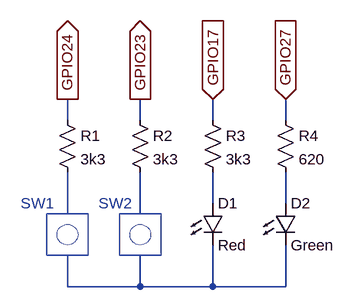
[diagram p0: schematic GpioBoard.asc]
GpioBoard.asc, the LTspice schematic file:
Version 4
SHEET 1 880 680
WIRE -64 -208 -64 -240
WIRE 48 -208 48 -240
WIRE 160 -208 160 -240
WIRE 272 -208 272 -240
WIRE 160 -80 160 -128
WIRE 272 -80 272 -128
WIRE -64 -64 -64 -128
WIRE 48 -64 48 -128
WIRE -64 48 -64 0
WIRE 48 48 48 0
WIRE 48 48 -64 48
WIRE 160 48 160 -16
WIRE 160 48 48 48
WIRE 272 48 272 -16
WIRE 272 48 160 48
FLAG 160 -240 GPIO17
IOPIN 160 -240 In
FLAG 272 -240 GPIO27
IOPIN 272 -240 In
FLAG 48 -240 GPIO23
IOPIN 48 -240 Out
FLAG -64 -240 GPIO24
IOPIN -64 -240 Out
SYMBOL LED 144 -80 R0
SYMATTR InstName D1
SYMATTR Value Red
SYMBOL LED 256 -80 R0
SYMATTR InstName D2
SYMATTR Value Green
SYMBOL res 144 -224 R0
SYMATTR InstName R3
SYMATTR Value 3k3
SYMBOL res 256 -224 R0
SYMATTR InstName R4
SYMATTR Value 620
SYMBOL res 32 -224 R0
SYMATTR InstName R2
SYMATTR Value 3k3
SYMBOL res -80 -224 R0
SYMATTR InstName R1
SYMATTR Value 3k3
TEXT -16 -80 Left 2 ;SW2
TEXT -136 -80 Left 2 ;SW1
RECTANGLE Normal 80 0 16 -64
RECTANGLE Normal -32 0 -96 -64
CIRCLE Normal 64 -16 32 -48 2
CIRCLE Normal -48 -16 -80 -48 2

The netlist it stands for:
* GpioBoard.asc
D1 N001 N005 Red
D2 N002 N005 Green
R3 GPIO17 N001 3k3
R4 GPIO27 N002 620
R2 GPIO23 N004 3k3
R1 GPIO24 N003 3k3
.model D D
.lib standard.dio
* SW2
* SW1
.backanno
.end